# EAGLE schematic Controle (EAGLE 9.6.2)
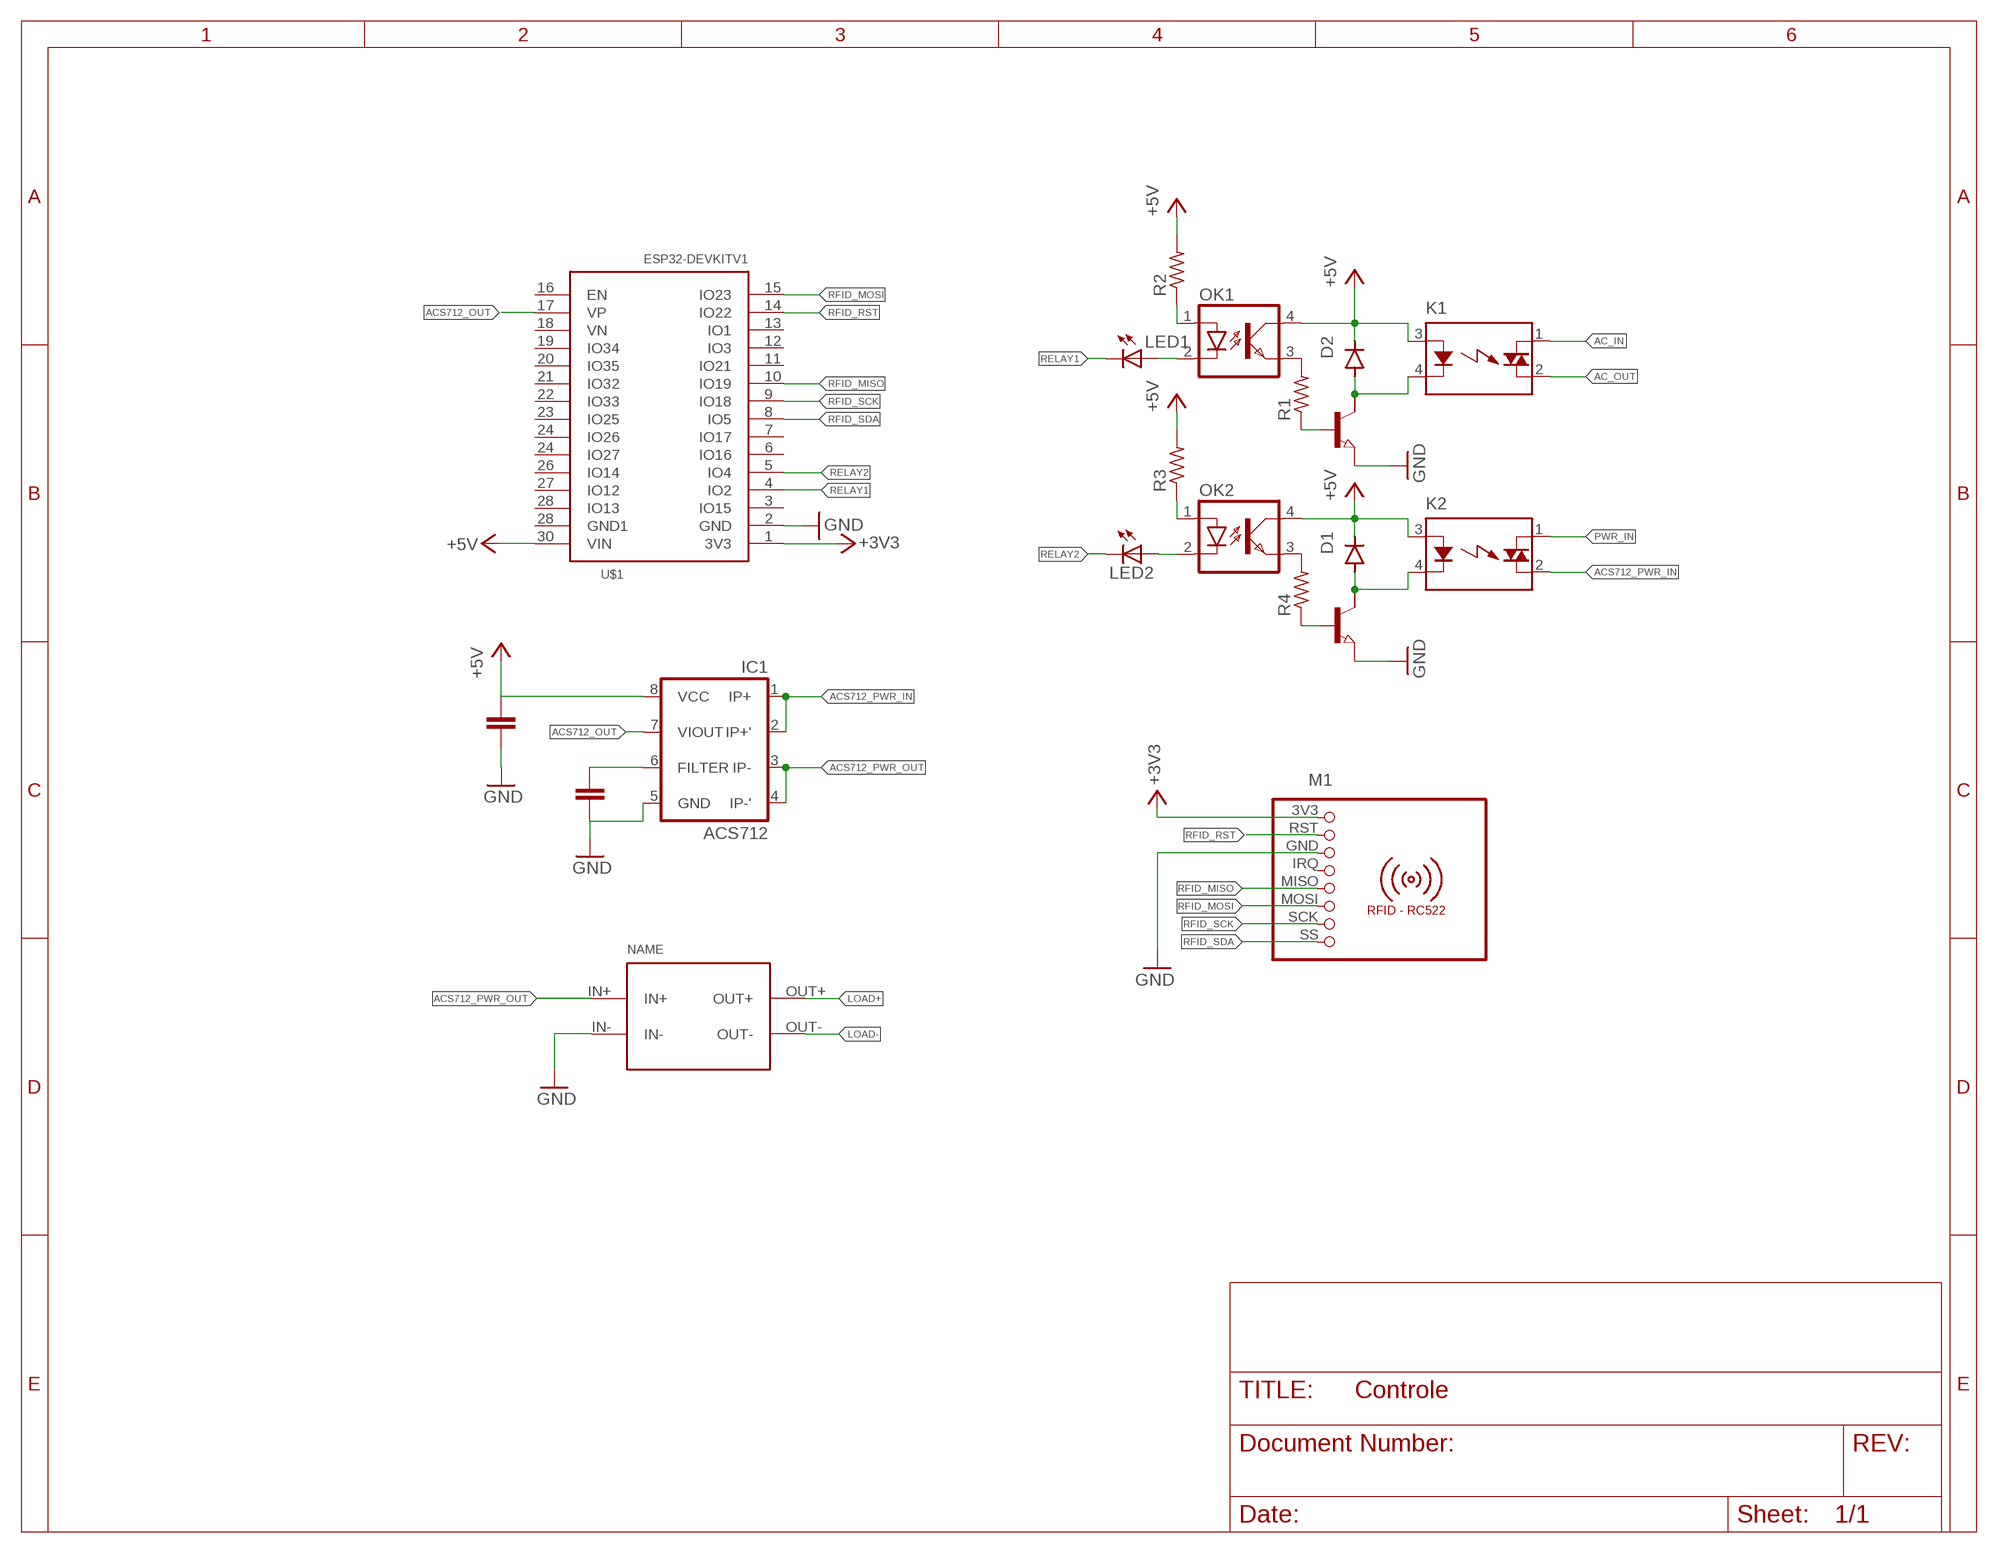
[diagram p0: schematic, sheet 1]

## Parts
D1  1N4004  [DO41-10]
D2  1N4004  [DO41-10]
IC1  ACS712  [SO08]
K1  AQ2A2-J-ZP3  [AQ1-FLAT]
K2  AQ2A2-J-ZP3  [AQ1-FLAT]
LED1  LED  [SMARTLED-TTW]
LED2  LED  [SMARTLED-TTW]
M1  RFID-RC522  [RFID-RC522]
OK1  SFH618A-3X006  [DIP4-400]
OK2  SFH618A-3X006  [DIP4-400]
Q1  NPN-TRANSISTIOR-2COLSOT89  [SOT89]
Q2  NPN-TRANSISTIOR-2COLSOT89  [SOT89]
R1  R-US_M0805  [M0805]
R2  R-US_M0805  [M0805]
R3  R-US_M0805  [M0805]
R4  R-US_M0805  [M0805]
U$1  ESP32DEVKITV1  [ESP32-DEVKITV1]
U$2  CONVERSOR_DC/DC  [CP8-ADJ]

## Nets
+3V3 [New Class]: M1.3V3 U$1.1(3V3)
+5V [New Class]: D1.C D2.C IC1.8(VCC) K1.3(A) K2.3(A) OK1.4(COL) OK2.4(COL) R2.2 R3.2 U$1.30(VIN)
AC_IN: K1.1(DS1)
AC_OUT: K1.2(DS2)
ACS712_OUT: IC1.7(VIOUT) U$1.17(VP)
ACS712_PWR_IN: IC1.1(IP+) IC1.2(IP+') K2.2(DS2)
ACS712_PWR_OUT: IC1.3(IP-) IC1.4(IP-') U$2.IN+
GND [New Class]: IC1.5(GND) M1.GND Q1.3(E) Q2.3(E) U$1.2(GND) U$2.IN-
LOAD+: U$2.OUT+
LOAD-: U$2.OUT-
N$1: D1.A K2.4(K) Q1.2(C)
N$2: D2.A K1.4(K) Q2.2(C)
N$3: OK2.1(A) R3.1
N$5: OK1.1(A) R2.1
N$6: LED1.A@1(A) OK1.2(C)
N$7: OK1.3(EMIT) R1.2
N$8: Q2.1(B) R1.1
N$10: LED2.A@1(A) OK2.2(C)
N$11: OK2.3(EMIT) R4.2
N$12: Q1.1(B) R4.1
N$19: IC1.6(FILTER)
PWR_IN: K2.1(DS1)
RELAY1: LED1.C@1(C) U$1.4(IO2)
RELAY2: LED2.C@1(C) U$1.5(IO4)
RFID_MISO [New Class]: M1.MISO U$1.10(IO19)
RFID_MOSI [New Class]: M1.MOSI U$1.15(IO23)
RFID_RST [New Class]: M1.RST U$1.14(IO22)
RFID_SCK [New Class]: M1.SCK U$1.9(IO18)
RFID_SDA [New Class]: M1.SS U$1.8(IO5)
Unconnected: M1.IRQ Q1.2@1(C/) Q2.2@1(C/) U$1.3(IO15) U$1.6(IO16) U$1.7(IO17) U$1.11(IO21) U$1.12(IO3) U$1.13(IO1) U$1.16(EN) U$1.18(VN) U$1.19(IO34) U$1.20(IO35) U$1.21(IO32) U$1.22(IO33) U$1.23(IO25) U$1.24(IO26) U$1.24(IO27) U$1.26(IO14) U$1.27(IO12) U$1.28(GND1) U$1.28(IO13)

## Library data of the parts
D1 D2 = diode:1N4004: DIODE general purpose rectifier, 1 A
IC1 = untitled:ACS712
K1 K2 = relay:AQ?: SOLID STATE RELAY NAiS Source: http://www.mew-europe.com/.. en_ds_61601_0000.pdf; MPN: AQ2A2-ZP3/28VDC; OC_FARNELL: 1163552; OC_NEWARK: 13P1232
LED1 LED2 = adafruit:LED: LED OSRAM: - CHIPLED LG R971, LG N971, LY N971, LG Q971, LY Q971, LO R971, LY R971 LH N974, LH R974 LS Q976, LO Q976, LY Q976 LO Q996 - Hyper CHIPLED LW Q18S LB Q993, LB Q99A, LB R99A - SideLED LS A670, LO A670, LY A670, LG A670, LP A670 LB A673, LV A673, LT A673, LW A673 LH A674 LY A675 LS A676, LA A676, LO A676, LY A676, LW A676 LS A679, LY A679, LG A679 - Hyper Micro SIDELED® LS Y876, LA Y876, LO Y876, LY Y876 LT Y87S - SmartLED LW L88C, LW L88S LB L89C, LB L89S, LG L890 LS L89K, LO L89K, LY L89K LS L896, LA L896, LO L896, LY L896 - TOPLED LS T670, LO T670, LY T670, LG T670, LP T670 LSG T670, LSP T670, LSY T670, LOP T670, LYG T670 LG T671, LOG T671, LSG T671 LB T673, LV T673, LT T673, LW T673 LH T674 LS T676, LA T676, LO T676, LY T676, LB T676, LH T676, LSB T676, LW T676 LB T67C, LV T67C, LT T67C, LS T67K, LO T67K, LY T67K, LW E67C LS E67B, LA E67B, LO E67B, LY E67B, LB E67C, LV E67C, LT E67C LW T67C LS T679, LY T679, LG T679 LS T770, LO T770, LY T770, LG T770, LP T770 LB T773, LV T773, LT T773, LW T773 LH T774 LS E675, LA E675, LY E675, LS T675 LS T776, LA T776, LO T776, LY T776, LB T776 LHGB T686 LT T68C, LB T68C - Hyper Mini TOPLED® LB M676 - Mini TOPLED Santana® LG M470 LS M47K, LO M47K, LY M47K Source: http://www.osram.convergy.de/
M1 = mfrc522-module:RFID-RC522: RFID-RC522 MFRC-522 based breakout board
OK1 OK2 = optocoupler:SFH618?*: Optocoupler, Phototransistor Output, Low Input Current Source: Data sheet <http://www.vishay.com/docs/83673/sfh618.pdf>; MPN: SFH618A-3X006; OC_FARNELL: unknown; OC_NEWARK: 43K9541
Q1 Q2 = semicon-smd-ipc:NPN-TRANSISTIOR-2COL: NPN TRANSISTOR 2 colletor pins
R1-R4 = rcl:R-US_: RESISTOR, American symbol; SPICEPREFIX: R
U$1 = ESP32-DEVKITV1:ESP32DEVKITV1
U$2 = userlib:CONVERSOR_DC/DC: Voltage regulator IN: 7-35V OUT: ADJ